# EAGLE design GPIO-Adapter_v10 (EAGLE 6.6.0)
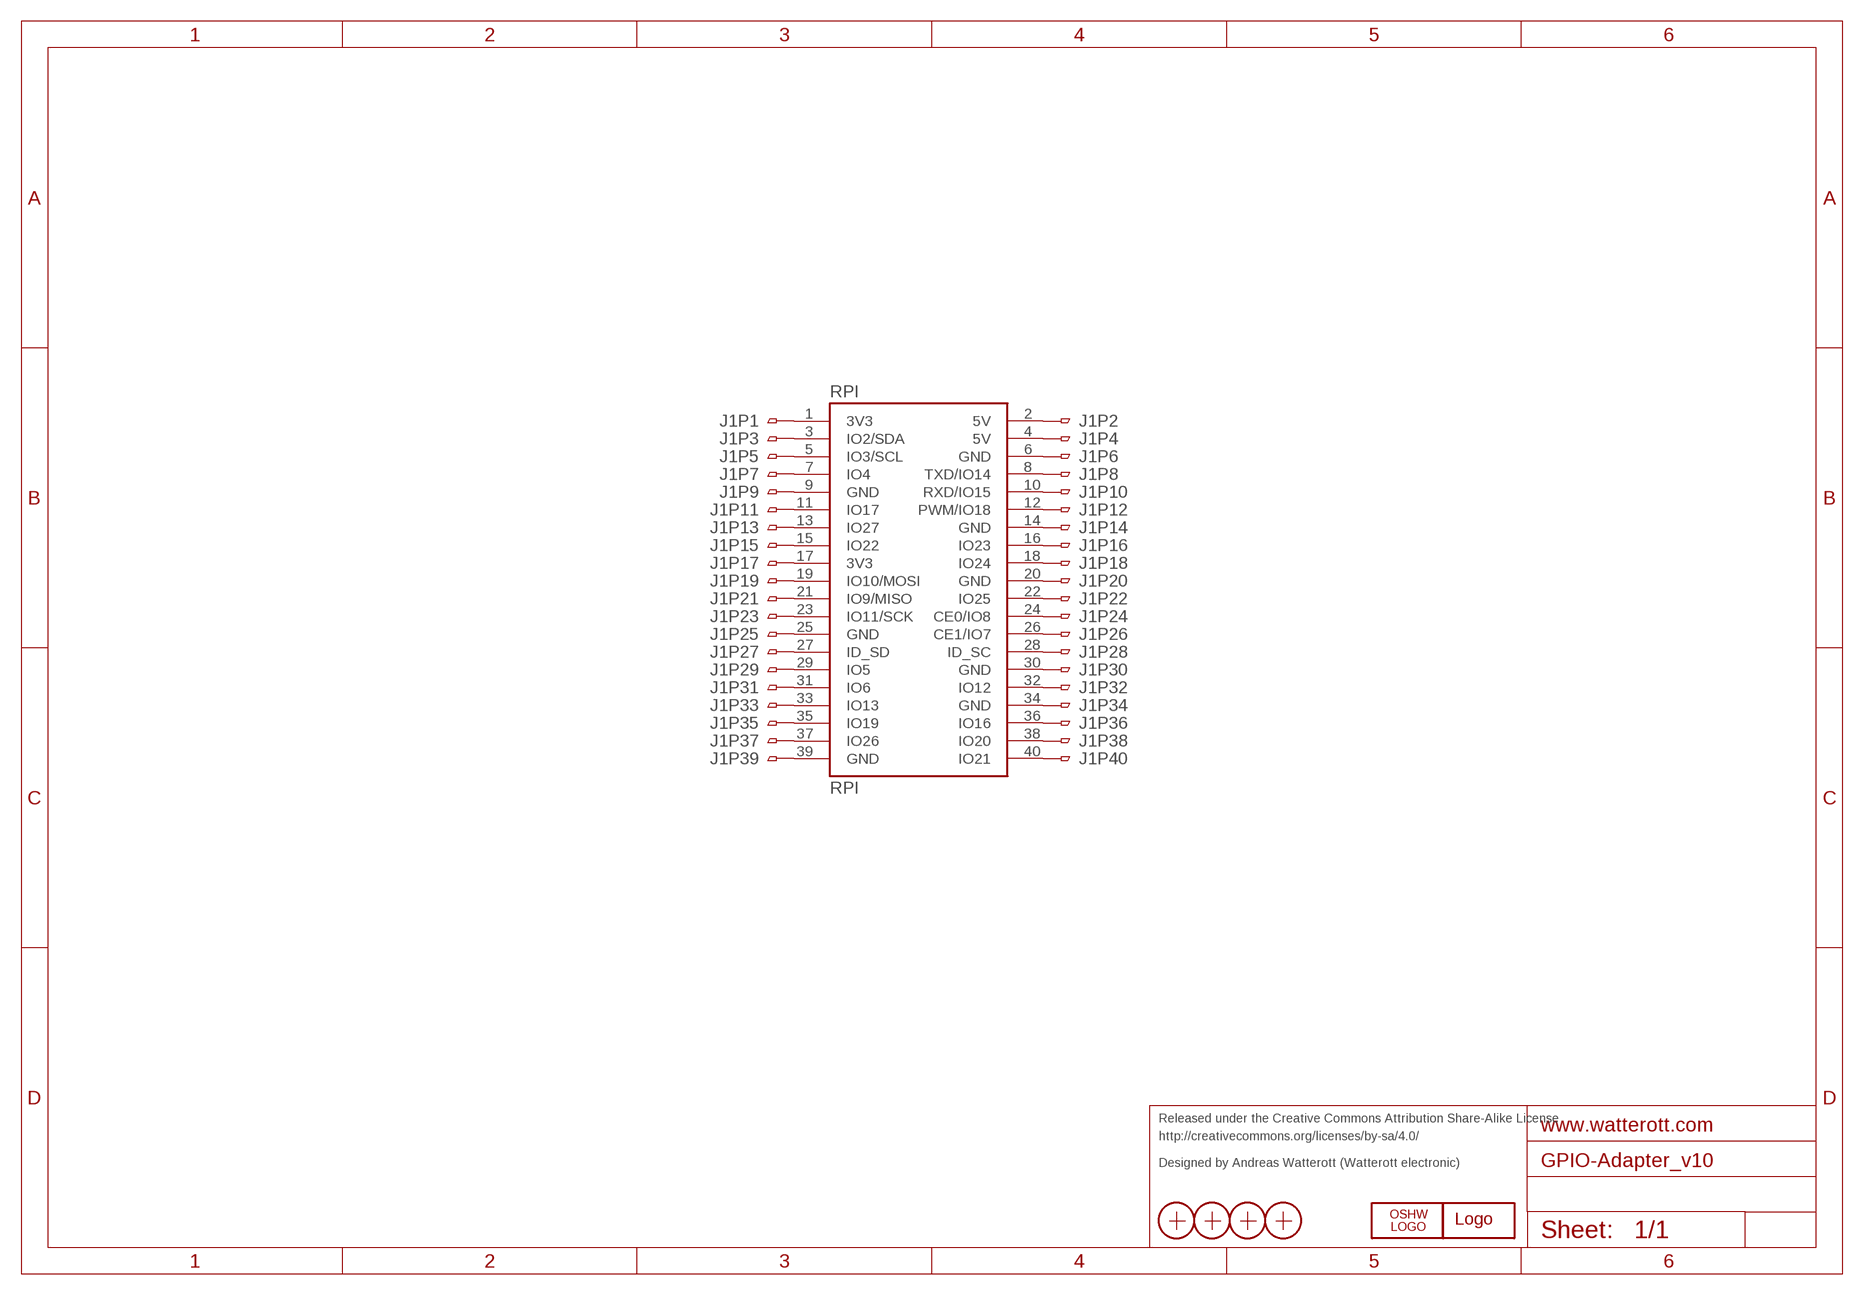
[diagram p0: schematic, sheet 1]

## Parts
J1  FPC40_PIN  [FPC40]
LOGO1  OSHW_LOGO_6MILX0150-NT  [OSHW_6X150_NOTEXT]
LOGO2  LOGO-S_PLACE_M  [SPARK_TPLACE_M]
RPI  RPI  RPI_B+-CON  [RPI-B+_CON]
X1  PASSER  [PASSER]
X2  PASSER  [PASSER]
X3  PASSER  [PASSER]
X4  PASSER  [PASSER]

## Nets
N$1: J1.40 RPI.40(IO21)
N$2: J1.2 RPI.2(5V)
N$3: J1.3 RPI.3(IO2/SDA)
N$4: J1.4 RPI.4(5V)
N$5: J1.6 RPI.6(GND)
N$6: J1.5 RPI.5(IO3/SCL)
N$7: J1.7 RPI.7(IO4)
N$8: J1.8 RPI.8(TXD/IO14)
N$9: J1.9 RPI.9(GND)
N$10: J1.10 RPI.10(RXD/IO15)
N$11: J1.11 RPI.11(IO17)
N$12: J1.12 RPI.12(PWM/IO18)
N$13: J1.13 RPI.13(IO27)
N$14: J1.14 RPI.14(GND)
N$15: J1.15 RPI.15(IO22)
N$16: J1.16 RPI.16(IO23)
N$17: J1.17 RPI.17(3V3)
N$18: J1.18 RPI.18(IO24)
N$19: J1.19 RPI.19(IO10/MOSI)
N$20: J1.20 RPI.20(GND)
N$21: J1.21 RPI.21(IO9/MISO)
N$22: J1.22 RPI.22(IO25)
N$23: J1.23 RPI.23(IO11/SCK)
N$24: J1.24 RPI.24(CE0/IO8)
N$25: J1.25 RPI.25(GND)
N$26: J1.26 RPI.26(CE1/IO7)
N$27: J1.27 RPI.27(ID_SD)
N$28: J1.28 RPI.28(ID_SC)
N$29: J1.29 RPI.29(IO5)
N$30: J1.30 RPI.30(GND)
N$31: J1.31 RPI.31(IO6)
N$32: J1.32 RPI.32(IO12)
N$33: J1.33 RPI.33(IO13)
N$34: J1.34 RPI.34(GND)
N$35: J1.35 RPI.35(IO19)
N$36: J1.36 RPI.36(IO16)
N$37: J1.37 RPI.37(IO26)
N$38: J1.38 RPI.38(IO20)
N$39: J1.1 RPI.1(3V3)
N$40: J1.39 RPI.39(GND)

## Notes on the sheet
- Released under the Creative Commons Attribution Share-Alike License
- http://creativecommons.org/licenses/by-sa/4.0/
- Designed by Andreas Watterott (Watterott electronic)

## Library data of the parts
J1 = we-con:FPC40_PIN: FPC/ZIF Connector
LOGO1 = OSHW:OSHW_LOGO_6MIL
LOGO2 = we-symbol:LOGO: Watterott electronic Logo
RPI = we-board:RPI_B+: Raspberry Pi Model B+
X1-X4 = SMD:PASSER

## Board
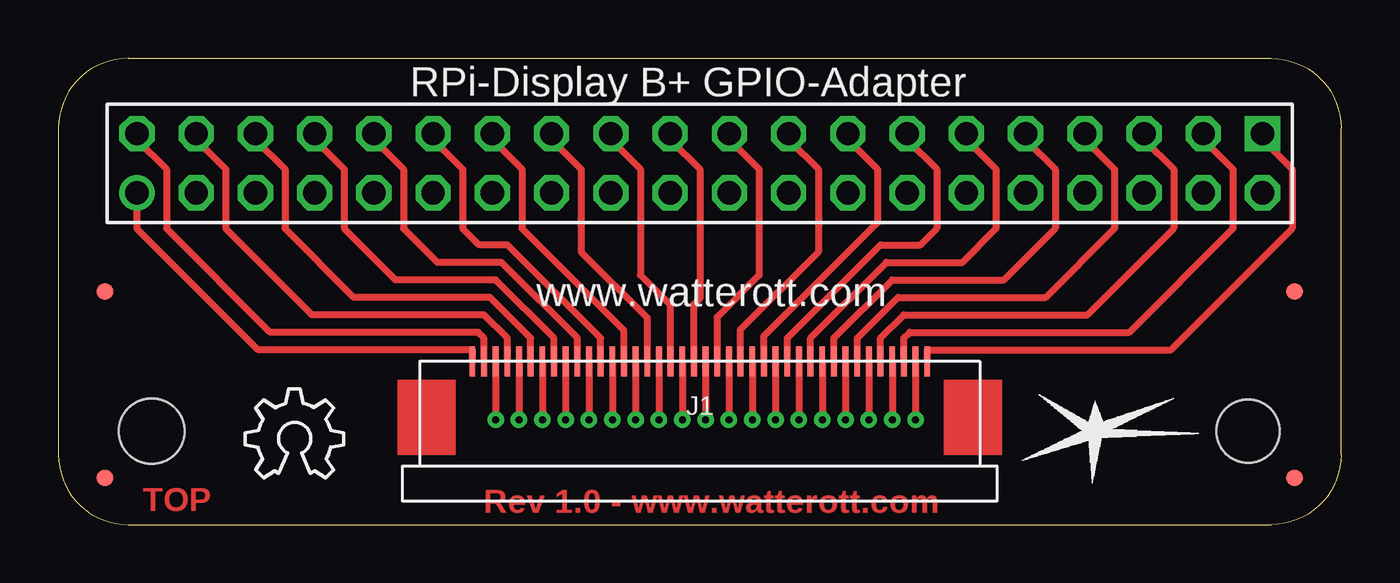
[diagram p1: board, top side]
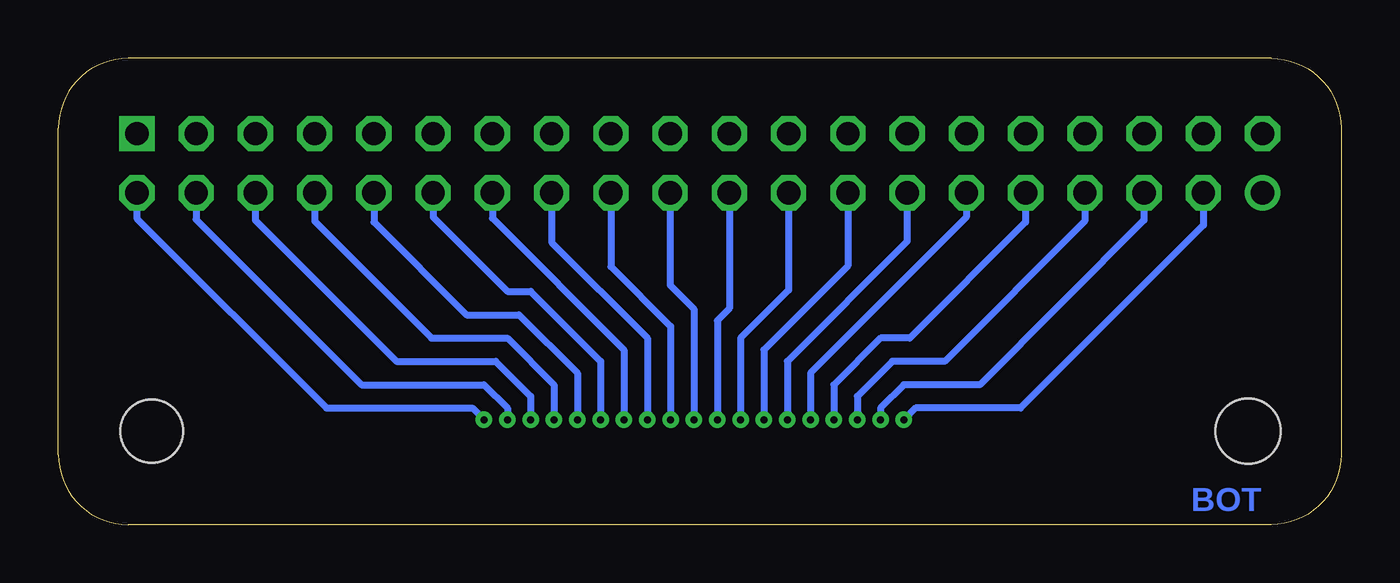
[diagram p2: board, bottom side, seen from below]

Size 55 x 20 mm. Coordinates in mm from the lower left corner, seen from the top.
Outline: 3,0 52,0 arc90 55,3 55,17 arc90 52,20 3,20 arc90 0,17 0,3 arc90 3,0
Copper layers (1*16): Top 0.035mm / dielectric 1.5mm / Bottom 0.035mm
Design rules "default *": minimum track width 6mil, minimum drill 0.3mm, track to track 6mil, track to pad 6mil, pad to pad 6mil, via to via 6mil, smd to smd 6mil, copper to edge 20mil, drill to drill 8mil, minimum pad ring 10mil, minimum via ring 8mil, stop-mask expansion 0.3mm, vias tented up to drill 0.5mm, thermal gap 10mil
Holes 2.7 mm at 51,4
Holes 2.8 mm at 4,4

### Footprints (pad centres in the part's own frame; a part is rotated, then mirrored left to right if it is on the bottom)
FPC40 = smd 1.27 x 0.279: 1 0.003,9.75; 2 0.003,9.25; 3 0.003,8.75; 4 0.003,8.25; 5 0.003,7.75; 6 0.003,7.25; 7 0.003,6.75; 8 0.003,6.25; 9 0.003,5.75; 10 0.003,5.25; 11 0.003,4.75; 12 0.003,4.25; 13 0.003,3.75; 14 0.003,3.25; 15 0.003,2.75; 16 0.003,2.25; 17 0.003,1.75; 18 0.003,1.25; 19 0.003,0.75; 20 0.003,0.25; 21 0.003,-0.25; 22 0.003,-0.75; 23 0.003,-1.25; 24 0.003,-1.75; 25 0.003,-2.25; 26 0.003,-2.75; 27 0.003,-3.25; 28 0.003,-3.75; 29 0.003,-4.25; 30 0.003,-4.75; 31 0.003,-5.25; 32 0.003,-5.75; 33 0.003,-6.25; 34 0.003,-6.75; 35 0.003,-7.25; 36 0.003,-7.75; 37 0.003,-8.25; 38 0.003,-8.75; 39 0.003,-9.25; 40 0.003,-9.75
RPI-B+_CON = drill 1 square: 1 -24.13,-1.27 | drill 1 octagon: 2 -24.13,1.27; 3 -21.59,-1.27; 4 -21.59,1.27; 5 -19.05,-1.27; 6 -19.05,1.27; 7 -16.51,-1.27; 8 -16.51,1.27; 9 -13.97,-1.27; 10 -13.97,1.27; 11 -11.43,-1.27; 12 -11.43,1.27; 13 -8.89,-1.27; 14 -8.89,1.27; 15 -6.35,-1.27; 16 -6.35,1.27; 17 -3.81,-1.27; 18 -3.81,1.27; 19 -1.27,-1.27; 20 -1.27,1.27; 21 1.27,-1.27; 22 1.27,1.27; 23 3.81,-1.27; 24 3.81,1.27; 25 6.35,-1.27; 26 6.35,1.27; 27 8.89,-1.27; 28 8.89,1.27; 29 11.43,-1.27; 30 11.43,1.27; 31 13.97,-1.27; 32 13.97,1.27; 33 16.51,-1.27; 34 16.51,1.27; 35 19.05,-1.27; 36 19.05,1.27; 37 21.59,-1.27; 38 21.59,1.27; 39 24.13,-1.27 | drill 1: 40 24.13,1.27
PASSER = smd 0.7 x 0.7: X 0,0

### Placement (x,y rotation side)
J1  27.5,7 270 top
LOGO1  8,2 0 top
LOGO2  44.5,4 0 top
RPI  27.5,15.5 180 top
X1  2,2 0 top
X2  2,10 0 top
X3  53,10 0 top
X4  53,2 0 top

### Tracks (layer width: path | path; a pad name or v marks a point on that pad's centre or on a via)
N$1
  Top 0.305: RPI.40 3.37,12.7 8.57,7.5 17.75,7.5 J1.40
N$2  (via drill 0.3)
  Top 0.305: J1.2 v36.75,4.5
  Bottom 0.305: RPI.2 51.63,13.13 43.5,5 37.25,5 v36.75,4.5
N$3
  Top 0.305: RPI.3 49.09,16.51 50.36,15.24 50.36,12.7 45.91,8.25 36.5,8.25 36.25,8 J1.3
N$4  (via drill 0.3)
  Top 0.305: J1.4 v35.75,4.5
  Bottom 0.305: RPI.4 49.09,13.09 42,6 36.75,6 35.75,5 v35.75,4.5
N$5  (via drill 0.3)
  Top 0.305: J1.6 v34.75,4.5
  Bottom 0.305: RPI.6 46.55,13.05 40.5,7 36.25,7 34.75,5.5 v34.75,4.5
N$6
  Top 0.305: RPI.5 46.55,16.51 47.82,15.24 47.82,12.7 44.12,9 36.25,9 35.25,8 J1.5
N$7
  Top 0.305: RPI.7 44.01,16.51 45.28,15.24 45.28,12.7 42.33,9.75 36,9.75 34.25,8 J1.7
N$8  (via drill 0.3)
  Top 0.305: J1.8 v33.75,4.5
  Bottom 0.305: RPI.8 44.01,13.01 39,8 35.75,8 33.75,6 v33.75,4.5
N$9
  Top 0.305: RPI.9 41.47,16.51 42.74,15.24 42.74,12.7 40.54,10.5 35.75,10.5 33.25,8 J1.9
N$10  (via drill 0.3)
  Top 0.305: J1.10 v32.75,4.5
  Bottom 0.305: RPI.10 41.47,12.97 37.5,9 35.25,9 32.75,6.5 v32.75,4.5
N$11
  Top 0.305: RPI.11 38.93,16.51 40.2,15.24 40.2,12.7 38.75,11.25 35.5,11.25 32.25,8 J1.11
N$12  (via drill 0.3)
  Top 0.305: J1.12 v31.75,4.5
  Bottom 0.305: RPI.12 38.93,13.18 35.75,10 34.75,10 J1.12 v31.75,4.5
N$13
  Top 0.305: RPI.13 36.39,16.51 37.66,15.24 37.66,12.7 36.96,12 35.25,12 31.25,8 J1.13
N$14  (via drill 0.3)
  Top 0.305: J1.14 v30.75,4.5
  Bottom 0.305: RPI.14 36.39,13.14 30.75,7.5 v30.75,4.5
N$15
  Top 0.305: RPI.15 33.85,16.51 35.12,15.24 35.12,12.95 30.25,8.08 J1.15
N$16  (via drill 0.3)
  Top 0.305: J1.16 v29.75,4.5
  Bottom 0.305: RPI.16 33.85,12.1 29.75,8 v29.75,4.5
N$17
  Top 0.305: RPI.17 31.31,16.51 32.58,15.24 32.58,11.7 29.25,8.37 J1.17
N$18  (via drill 0.3)
  Top 0.305: J1.18 v28.75,4.5
  Bottom 0.305: RPI.18 31.31,11.06 28.75,8.5 v28.75,4.5
N$19
  Top 0.305: RPI.19 28.77,16.51 30.04,15.24 30.04,10.7 28.25,8.91 J1.19
N$20  (via drill 0.3)
  Top 0.305: J1.20 v27.75,4.5
  Bottom 0.305: RPI.20 28.77,10.27 27.75,9.25 v27.75,4.5
N$21
  Top 0.305: RPI.21 26.23,16.51 27.5,15.24 27.5,9.7 27.25,9.45 J1.21
N$22  (via drill 0.3)
  Top 0.305: J1.22 v26.75,4.5
  Bottom 0.305: RPI.22 26.23,9.27 26.75,8.75 v26.75,4.5
N$23
  Top 0.305: RPI.23 23.69,16.51 24.96,15.24 24.96,10.7 26.25,9.41 J1.23
N$24  (via drill 0.3)
  Top 0.305: J1.24 v25.75,4.5
  Bottom 0.305: RPI.24 23.69,10.06 25.75,8 v25.75,4.5
N$25
  Top 0.305: RPI.25 21.15,16.51 22.42,15.24 22.42,11.7 25.25,8.87 J1.25
N$26  (via drill 0.3)
  Top 0.305: J1.26 v24.75,4.5
  Bottom 0.305: RPI.26 21.15,11.1 24.75,7.5 v24.75,4.5
N$27
  Top 0.305: RPI.27 18.61,16.51 19.88,15.24 19.88,12.7 24.25,8.33 J1.27
N$28  (via drill 0.3)
  Top 0.305: J1.28 v23.75,4.5
  Bottom 0.305: RPI.28 18.61,12.14 J1.28 v23.75,4.5
N$29
  Top 0.305: RPI.29 16.07,16.51 17.34,15.24 17.34,12.7 18.04,12 19.25,12 23.25,8 J1.29
N$30  (via drill 0.3)
  Top 0.305: J1.30 v22.75,4.5
  Bottom 0.305: RPI.30 16.07,13.18 22.75,6.5 v22.75,4.5
N$31
  Top 0.305: RPI.31 13.53,16.51 14.8,15.24 14.8,12.7 16.25,11.25 19,11.25 22.25,8 J1.31
N$32  (via drill 0.3)
  Top 0.305: J1.32 v21.75,4.5
  Bottom 0.305: RPI.32 13.53,12.97 18.5,8 19.75,8 21.75,6 v21.75,4.5
N$33
  Top 0.305: RPI.33 10.99,16.51 12.26,15.24 12.26,12.7 14.46,10.5 18.75,10.5 21.25,8 J1.33
N$34  (via drill 0.3)
  Top 0.305: J1.34 v20.75,4.5
  Bottom 0.305: RPI.34 10.99,13.01 17,7 19.25,7 20.75,5.5 v20.75,4.5
N$35
  Top 0.305: RPI.35 8.45,16.51 9.72,15.24 9.72,12.7 12.67,9.75 18.5,9.75 20.25,8 J1.35
N$36  (via drill 0.3)
  Top 0.305: J1.36 v19.75,4.5
  Bottom 0.305: RPI.36 8.45,13.05 15.5,6 18.75,6 19.75,5 v19.75,4.5
N$37
  Top 0.305: RPI.37 5.91,16.51 7.18,15.24 7.18,12.7 10.88,9 18.25,9 19.25,8 J1.37
N$38  (via drill 0.3)
  Top 0.305: J1.38 v18.75,4.5
  Bottom 0.305: RPI.38 5.91,12.84 13.75,5 18.25,5 v18.75,4.5
N$39
  Top 0.305: RPI.1 51.63,16.51 52.9,15.24 52.9,12.7 47.7,7.5 37.25,7.5 J1.1
N$40
  Top 0.305: RPI.39 3.37,16.51 4.64,15.24 4.64,12.7 9.09,8.25 18,8.25 18.25,8 J1.39

### Text on the board
Top: TOP | Rev 1.0 - www.watterott.com
Bottom: BOT
tPlace: RPi-Display B+ GPIO-Adapter | www.watterott.com
Reference: Silkscreen: 21 tPlace